# EAGLE design 01_giris (EAGLE 9.6.2)
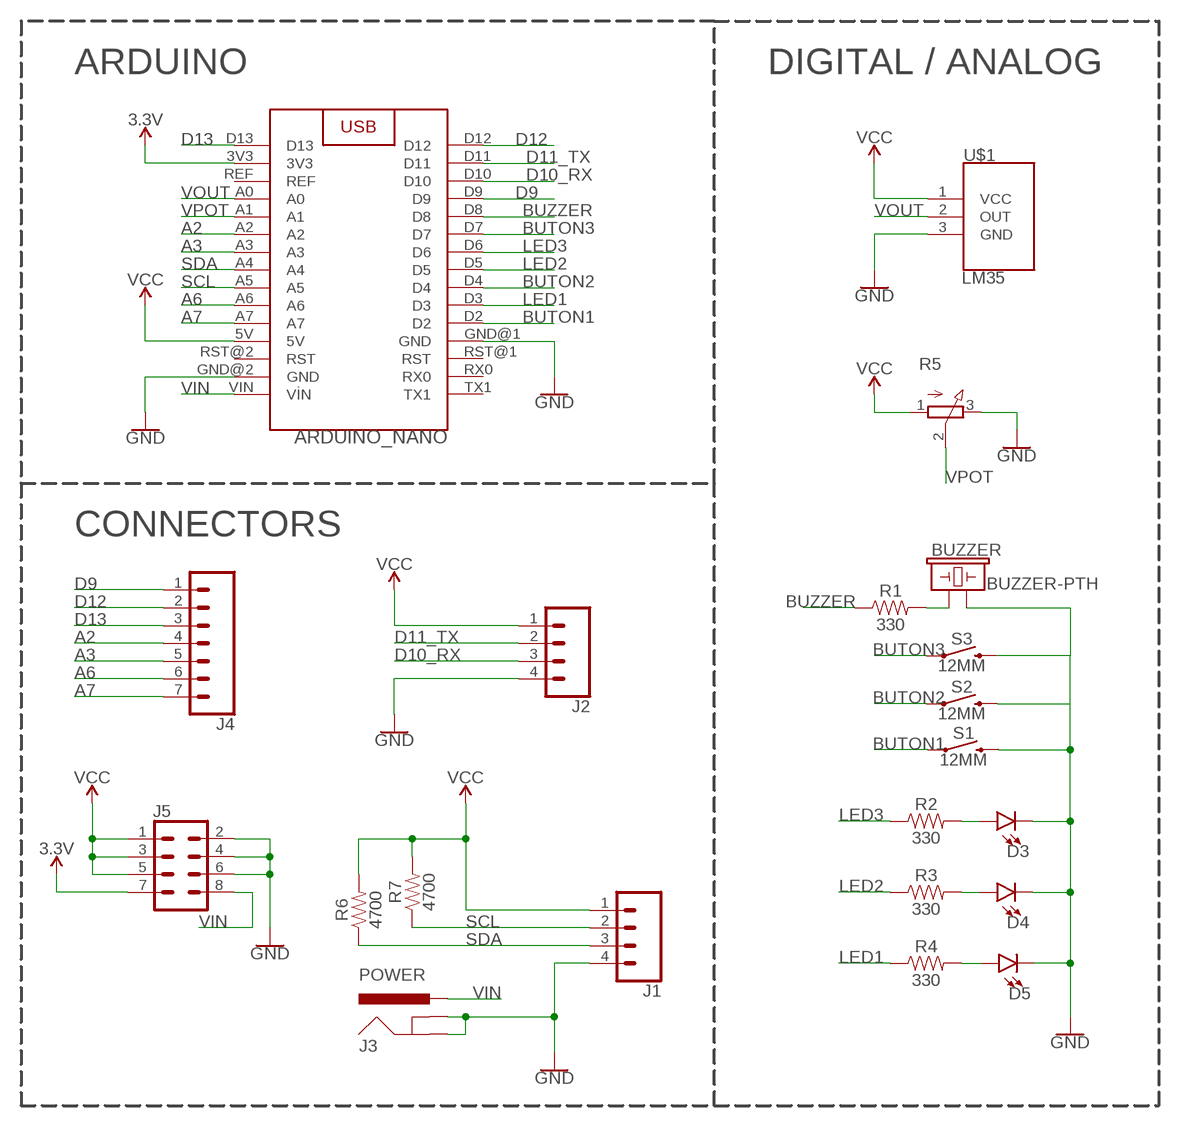
[diagram p0: schematic, sheet 1]

## Parts
ARDUINO_NANO  ARDUINO_NANO  [ARDUINO_NANO]
BUZZER  BUZZER-PTH  [BUZZER-12MM]
D3  LED-3MM-NO_SILK  [LED_3MM-NS]
D4  LED-3MM-NO_SILK  [LED_3MM-NS]
D5  LED-3MM-NO_SILK  [LED_3MM-NS]
J1  CONN_04  [1X04]
J2  CONN_04  [1X04]
J3  POWER  POWER_JACK  [POWER_JACK_PTH]
J4  CONN_07  [1X07]
J5  CONN_04X2  [2X4]
R1  330  1KOHM-HORIZ-1/4W-5%  [AXIAL-0.3]
R2  330  1KOHM-HORIZ-1/4W-5%  [AXIAL-0.3]
R3  330  1KOHM-HORIZ-1/4W-5%  [AXIAL-0.3]
R4  330  1KOHM-HORIZ-1/4W-5%  [AXIAL-0.3]
R5  3RP/1610N  [3RP/1610N]
R6  4700  1KOHM-HORIZ-1/4W-5%  [AXIAL-0.3]
R7  4700  1KOHM-HORIZ-1/4W-5%  [AXIAL-0.3]
S1  12MM  MOMENTARY-SWITCH-SPST-PTH-12MM  [TACTILE_SWITCH_PTH_12MM]
S2  12MM  MOMENTARY-SWITCH-SPST-PTH-12MM  [TACTILE_SWITCH_PTH_12MM]
S3  12MM  MOMENTARY-SWITCH-SPST-PTH-12MM  [TACTILE_SWITCH_PTH_12MM]
U$1  LM35  [TO-92]

## Nets
3.3V: ARDUINO_NANO.3V3 J5.7
A2: ARDUINO_NANO.A2 J4.4
A3: ARDUINO_NANO.A3 J4.5
A6: ARDUINO_NANO.A6 J4.6
A7: ARDUINO_NANO.A7 J4.7
BUTON1: ARDUINO_NANO.D2 S1.1
BUTON2: ARDUINO_NANO.D4 S2.1
BUTON3: ARDUINO_NANO.D7 S3.1
BUZZER: ARDUINO_NANO.D8 R1.P$1
D9: ARDUINO_NANO.D9 J4.1
D10_RX: ARDUINO_NANO.D10 J2.3
D11_TX: ARDUINO_NANO.D11 J2.2
D12: ARDUINO_NANO.D12 J4.2
D13: ARDUINO_NANO.D13 J4.3
GND: ARDUINO_NANO.GND@1(GND) ARDUINO_NANO.GND@2(GND) BUZZER.- D3.K(C) D4.K(C) D5.K(C) J1.4 J2.4 J3.GND J3.GNDBREAK J5.2 J5.4 J5.6 R5.3(E) S1.3 S2.3 S3.3 U$1.3(GND)
LED1: ARDUINO_NANO.D3 R4.P$1
LED2: ARDUINO_NANO.D5 R3.P$1
LED3: ARDUINO_NANO.D6 R2.P$1
N$1: BUZZER.+ R1.P$2
N$6: D3.A R2.P$2
N$7: D4.A R3.P$2
N$8: D5.A R4.P$2
SCL: ARDUINO_NANO.A5 J1.2 R7.P$1
SDA: ARDUINO_NANO.A4 J1.3 R6.P$1
VCC: ARDUINO_NANO.5V J1.1 J2.1 J5.1 J5.3 J5.5 R5.1(A) R6.P$2 R7.P$2 U$1.1(VCC)
VIN: ARDUINO_NANO.VIN(VİN) J3.PWR J5.8
VOUT: ARDUINO_NANO.A0 U$1.2(OUT)
VPOT: ARDUINO_NANO.A1 R5.2(S)
Unconnected: ARDUINO_NANO.REF ARDUINO_NANO.RST@1(RST) ARDUINO_NANO.RST@2(RST) ARDUINO_NANO.RX0 ARDUINO_NANO.TX1

## Notes on the sheet
- ARDUINO | DIGITAL / ANALOG
- CONNECTORS

## Library data of the parts
ARDUINO_NANO = ArduinoModelleri:ARDUINO_NANO: Arduino Nano Device
BUZZER = SparkFun-Electromechanical:BUZZER: Buzzer Small round buzzers that operate around the audible 2kHz range. You can use these as speakers to create simple music or user interfaces. Variant Overview: PTH - Mini Speaker - PC Mount 12mm 2.048kHz <https://www.sparkfun.com/products/7950> PTH_KIT - Mini Speaker - PC Mount 12mm 2.048kHz <https://www.sparkfun.com/products/7950> KIT simplifies soldering by adding stop mask to one side of the pads. PTH_NO_SILK - Mini Speaker - PC Mount 12mm 2.048kHz <https://www.sparkfun.com/products/7950> No silkscreen indicator of buzzer outline. PTH_KIT_NO_SILK - Mini Speaker - PC Mount 12mm 2.048kHz <https://www.sparkfun.com/products/7950> KIT package w/o silkscreen SMD - Buzzer Audio Magnetic (CCV-084B16) SMD buzzer used on, e.g. the LilyPad Buzzer <https://www.sparkfun.com/products/8463> and RFID USB Reader <https://www.sparkfun.com/products/9963>. SMD_KIT - Buzzer Audio Magnetic (CCV-084B16) SMD Buzzer with elongated pins to make soldering easier. Used on the SparkFun Simon Says - Surface Mount Soldering Kit <https://www.sparkfun.com/products/10935>.; PROD_ID: COMP-08253; SF_SKU: COM-07950
D3-D5 = SparkFun-LED:LED: LED (Generic) Standard schematic elements and footprints for 5mm, 3mm, 1206, and 0603 sized LEDs. Generic LEDs with no color specified.
J1 J2 = SparkFun-Connectors:CONN_04: Multi connection point. Often used as Generic Header-pin footprint for 0.1 inch spaced/style header connections On any of the 0.1 inch spaced packages, you can populate with these: Break Away Headers - Straight <https://www.sparkfun.com/products/116> (PRT-00116) Break Away Male Headers - Right Angle <https://www.sparkfun.com/products/553> (PRT-00553) Female Headers <https://www.sparkfun.com/products/115> (PRT-00115) Break Away Headers - Machine Pin <https://www.sparkfun.com/products/117> (PRT-00117) Break Away Female Headers - Swiss Machine Pin <https://www.sparkfun.com/products/743> (PRT-00743) For SCREWTERMINALS and SPRING TERMINALS visit here: Screw Terimnals on SparkFun.com <https://www.sparkfun.com/search/results?term=Screw+Terminals> (5mm/3.5mm/2.54mm spacing) This device is also useful as a general connection point to wire up your design to another part of your project. Our various solder wires solder well into these plated through hole pads. Hook-Up Wire - Assortment (Stranded, 22 AWG) <https://www.sparkfun.com/products/11375> (PRT-11375) Hook-Up Wire - Assortment (Solid Core, 22 AWG) <https://www.sparkfun.com/products/11367> (PRT-11367) View the entire wire category on our website here <https://www.sparkfun.com/categories/141> Special notes: Molex polarized connector foot print use with SKU : PRT-08231 with associated crimp pins and housings. 1MM SMD Version SKU: PRT-10208; PROD_ID: CONN-09696
J3 = SparkFun-Connectors:POWER_JACK: Power Jack Connector This is the standard 5.5mm barrel jack for power. The PTH is the most common, proven, reliable, footprint. The Slot footprint only works if the mill layer is transmitted to the PCB fab house so be warned. Here are the connectors we sell at SparkFun: DC Barrel Power Jack/Connector <https://www.sparkfun.com/products/119> (PRT-00119) DC Barrel Power Jack/Connector (SMD) <https://www.sparkfun.com/products/12748> (PRT-12748) DC Barrel Jack Adapter - Breadboard Compatible <https://www.sparkfun.com/products/10811> (PRT-10811) It is used on this SparkFun product (and many, many others): SparkFun RedBoard - Programmed with Arduino <https://www.sparkfun.com/products/12757> (DEV-12757) Also, if you need a mating power supply or connector, please check these out: Wall Adapter Power Supply - 9VDC 650mA <https://www.sparkfun.com/products/298> (TOL-00298) DC Barrel Jack Adapter - Male <https://www.sparkfun.com/products/10287> (PRT-10287); PROD_ID: CONN-08197
J4 = SparkFun-Connectors:CONN_07: Multi connection point. Often used as Generic Header-pin footprint for 0.1 inch spaced/style header connections On any of the 0.1 inch spaced packages, you can populate with these: Break Away Headers - Straight <https://www.sparkfun.com/products/116> (PRT-00116) Break Away Male Headers - Right Angle <https://www.sparkfun.com/products/553> (PRT-00553) Female Headers <https://www.sparkfun.com/products/115> (PRT-00115) Break Away Headers - Machine Pin <https://www.sparkfun.com/products/117> (PRT-00117) Break Away Female Headers - Swiss Machine Pin <https://www.sparkfun.com/products/743> (PRT-00743) For SCREWTERMINALS and SPRING TERMINALS visit here: Screw Terimnals on SparkFun.com <https://www.sparkfun.com/search/results?term=Screw+Terminals> (5mm/3.5mm/2.54mm spacing) This device is also useful as a general connection point to wire up your design to another part of your project. Our various solder wires solder well into these plated through hole pads. Hook-Up Wire - Assortment (Stranded, 22 AWG) <https://www.sparkfun.com/products/11375> (PRT-11375) Hook-Up Wire - Assortment (Solid Core, 22 AWG) <https://www.sparkfun.com/products/11367> (PRT-11367) View the entire wire category on our website here <https://www.sparkfun.com/categories/141> Special notes: Molex polarized connector foot print use with SKU : PRT-08231 with associated crimp pins and housings. 1MM SMD Version SKU: PRT-10208 NOTES ON THE VARIANTS LOCK and LOCK_LONGPADS... This footprint was designed to help hold the alignment of a through-hole component (i.e. 6-pin header) while soldering it into place. You may notice that each hole has been shifted either up or down by 0.005 of an inch from it's more standard position (which is a perfectly straight line). This slight alteration caused the pins (the squares in the middle) to touch the edges of the holes. Because they are alternating, it causes a "brace" to hold the component in place. 0.005 has proven to be the perfect amount of "off-center" position when using our standard breakaway headers. Although looks a little odd when you look at the bare footprint, once you have a header in there, the alteration is very hard to notice. Also,if you push a header all the way into place, it is covered up entirely on the bottom side.
J5 = SparkFun-Connectors:CONN_04X2: Multi connection point. Often used as Generic Header-pin footprint for 0.1 inch spaced/style header connections On any of the 0.1 inch spaced packages, you can populate with these: Break Away Headers - Straight <https://www.sparkfun.com/products/116> (PRT-00116) Break Away Male Headers - Right Angle <https://www.sparkfun.com/products/553> (PRT-00553) Female Headers <https://www.sparkfun.com/products/115> (PRT-00115) Break Away Headers - Machine Pin <https://www.sparkfun.com/products/117> (PRT-00117) Break Away Female Headers - Swiss Machine Pin <https://www.sparkfun.com/products/743> (PRT-00743)
R1-R4 R6 R7 = SparkFun-Resistors:1KOHM: 1kΩ resistor A resistor is a passive two-terminal electrical component that implements electrical resistance as a circuit element. Resistors act to reduce current flow, and, at the same time, act to lower voltage levels within circuits. - Wikipedia; PROD_ID: RES-08380; VALUE: 1k
R5 = pot:3RP/1610N: 16mm Potentiometer one level Source: http://www.alphapotentiometers.net/html/16mm_pot_2.html
S1-S3 = SparkFun-Switches:MOMENTARY-SWITCH-SPST: Momentary Switch (Pushbutton) - SPST Normally-open (NO) SPST momentary switches (buttons, pushbuttons). Variants PTH-12MM - 12mm square, through-hole Momentary Pushbutton Switch - 12mm Square <https://www.sparkfun.com/products/9190> (COM-09190) PTH-6.0MM, PTH-6.0MM-KIT - 6.0mm square, through-hole Mini Pushbutton Switch <https://www.sparkfun.com/products/97> (COM-00097) KIT package intended for soldering kit's - only one side of pads' copper is exposed. PTH-RIGHT-ANGLE-KIT - Right-angle, through-hole Right Angle Tactile Button <https://www.sparkfun.com/products/10791> - Used on SparkFun BigTime Watch Kit <https://www.sparkfun.com/products/11734> SMD-12MM - 12mm square, surface-mount Tactile Button - SMD (12mm) <https://www.sparkfun.com/products/12993> (COM-12993) Used on SparkFun PicoBoard <https://www.sparkfun.com/products/11888> SMD-4.5MM - 4.5mm Square Trackball Switch Used on SparkFun Blackberry Trackballer Breakout <https://www.sparkfun.com/products/13169> SMD-4.6MMX2.8MM - 4.60mm x 2.80mm, surface mount Used on SparkFun SAMD21 Mini Breakout <https://www.sparkfun.com/products/13664> SMD-5.2MM, SMD-5.2-REDUNDANT - 5.2mm square, surface-mount Mini Pushbutton Switch - SMD <https://www.sparkfun.com/products/8720> (COM-08720) Used on Arduino Pro Mini <https://www.sparkfun.com/products/11114> REDUNDANT package connects both switch circuits together SMD-6.0X3.5MM - 6.0 x 3.5mm, surface mount Momentary Reset Switch SMD <https://www.sparkfun.com/products/8229> (COM-08229) SMD-6.2MM-TALL - 6.2mm square, surface mount Tactile Button - SMD (6mm) <https://www.sparkfun.com/products/12992> Used on SparkFun Digital Sandbox <https://www.sparkfun.com/products/12651> SMD-RIGHT-ANGLE - Right-angle, surface mount Used on SparkFun Block for Intel® Edison - Arduino <https://www.sparkfun.com/products/13036>; PROD_ID: SWCH-09185; SF_SKU: COM-09190
U$1 = ArduinoModelleri:LM35

## Board
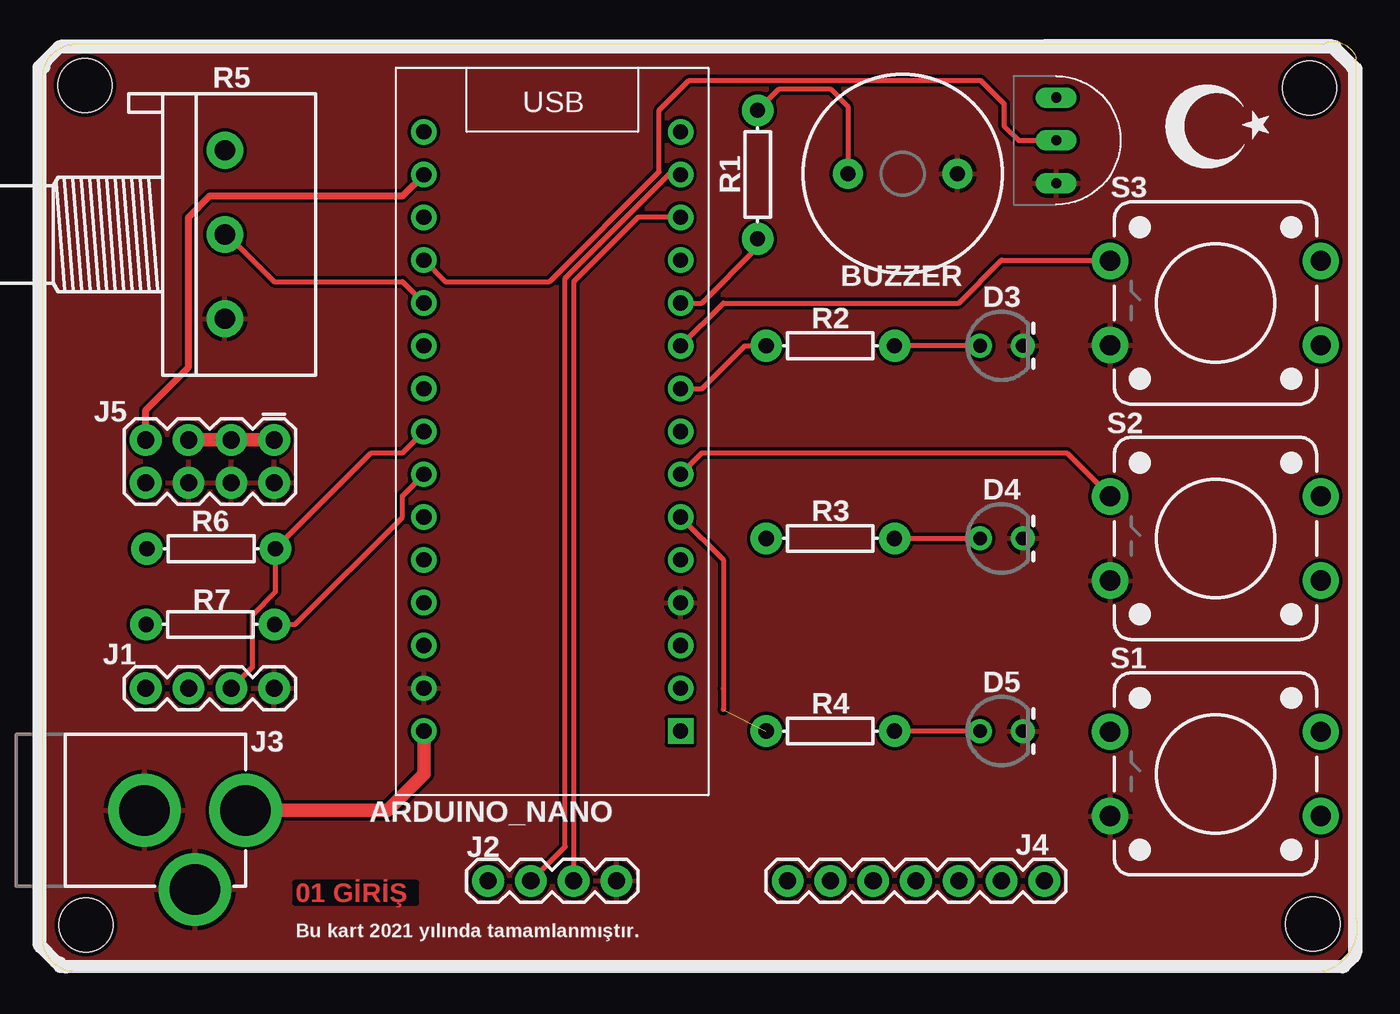
[diagram p1: board, top side]
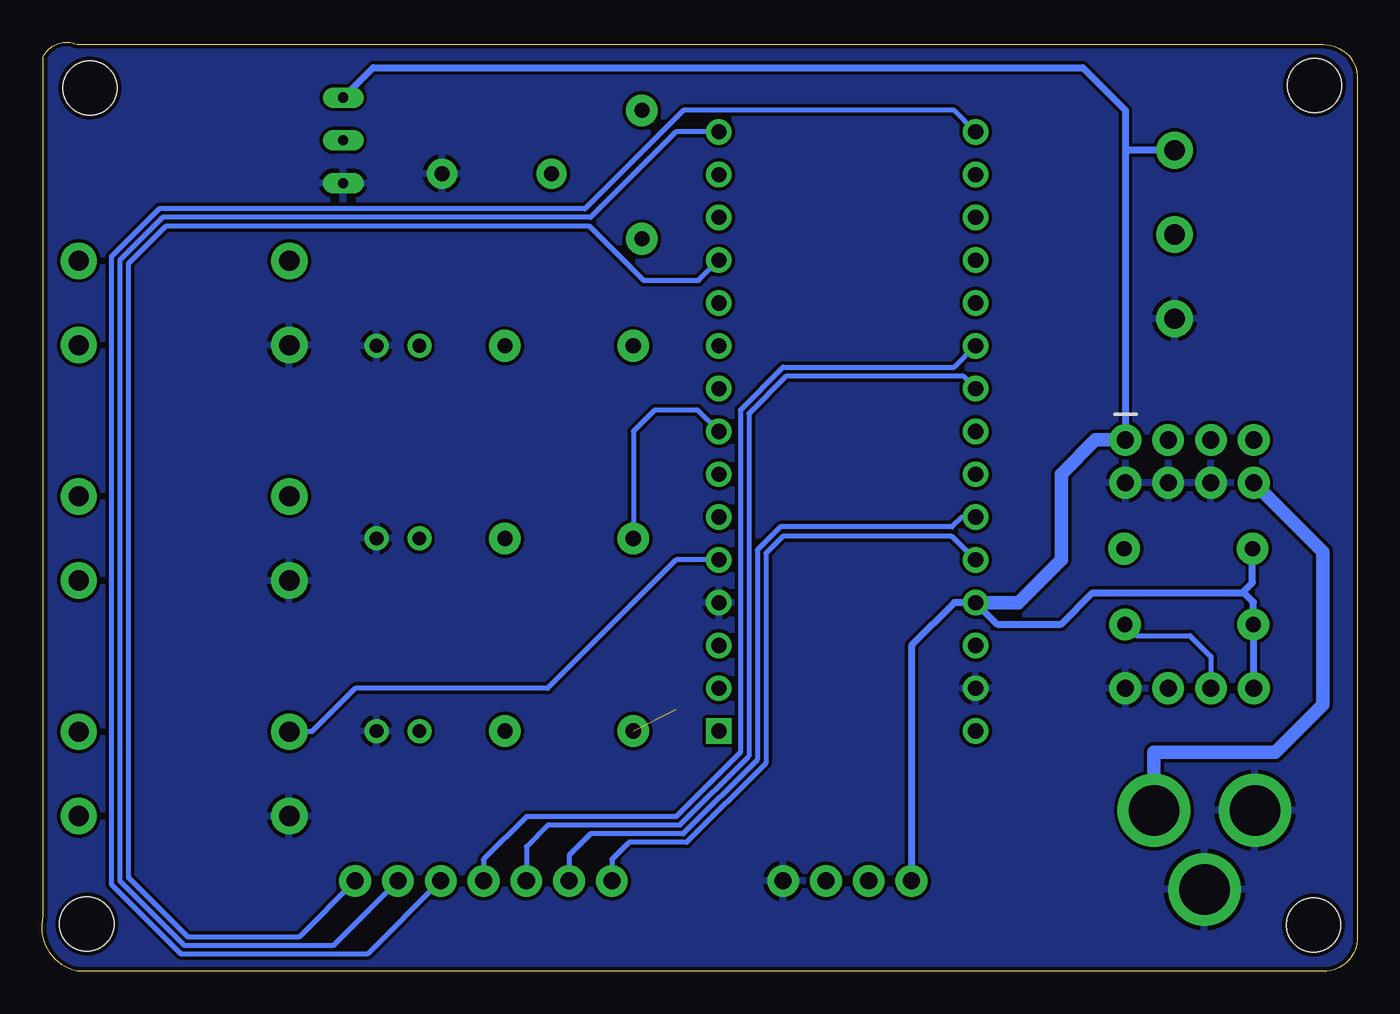
[diagram p2: board, bottom side, seen from below]

Size 78.07 x 55.14 mm. Coordinates in mm from the lower left corner, seen from the top.
Outline: 76,55 2,55 arc90 0,53 0,2 arc90 2,0 76,0 arc90 78,3.27 78,54.27 arc90 76,55
Copper layers (1*16): Top 0.035mm / dielectric 1.5mm / Bottom 0.035mm
Design rules "SparkFun": minimum track width 8mil, minimum drill 20mil, track to track 8mil, track to pad 8mil, pad to pad 8mil, via to via 8mil, smd to smd 8mil, copper to edge 10mil, drill to drill 8mil, minimum pad ring 12mil, minimum via ring 10mil, stop-mask expansion 4mil, vias tented up to drill 25mil, thermal gap 10mil
Holes 3.2 mm at 75.23,52.43 75.43,2.81 2.55,52.56 2.6,2.75

### Footprints (pad centres in the part's own frame; a part is rotated, then mirrored left to right if it is on the bottom)
ARDUINO_NANO = drill 0.9: 3V3 7.62,-15.24; 5V 7.62,10.16; A0 7.62,-10.16; A1 7.62,-7.62; A2 7.62,-5.08; A3 7.62,-2.54; A4 7.62,0; A5 7.62,2.54; A6 7.62,5.08; A7 7.62,7.62; D2 -7.62,7.62; D3 -7.62,5.08; D4 -7.62,2.54; D5 -7.62,0; D6 -7.62,-2.54; D7 -7.62,-5.08; D8 -7.62,-7.62; D9 -7.62,-10.16; D10 -7.62,-12.7; D11 -7.62,-15.24; D12 -7.62,-17.78; D13 7.62,-17.78; GND@1 -7.62,10.16; GND@2 7.62,15.24; REF 7.62,-12.7; RST@1 -7.62,12.7; RST@2 7.62,12.7; RX0 -7.62,15.24; VIN 7.62,17.78 | drill 0.9 square: TX1 -7.62,17.78
BUZZER-12MM = drill 0.9 pad 1.778: + 3.25,0; - -3.25,0
LED_3MM-NS = drill 0.813: A -1.27,0; K 1.27,0
1X04 = drill 1.016 pad 1.88: 1 0,0; 2 2.54,0; 3 5.08,0; 4 7.62,0
POWER_JACK_PTH = drill 2.997 pad 4.318: GND 0,7.7; GNDBREAK 4.7,10.7; PWR 0,13.7
1X07 = drill 1.016 pad 1.88: 1 0,0; 2 2.54,0; 3 5.08,0; 4 7.62,0; 5 10.16,0; 6 12.7,0; 7 15.24,0
2X4 = drill 1.016 pad 1.88: 1 -3.81,-1.27; 2 -3.81,1.27; 3 -1.27,-1.27; 4 -1.27,1.27; 5 1.27,-1.27; 6 1.27,1.27; 7 3.81,-1.27; 8 3.81,1.27
AXIAL-0.3 = drill 0.9 pad 1.88: P$1 -3.81,0; P$2 3.81,0
3RP/1610N = drill 1.2 pad 2.184: 1 -5,0; 2 0,0; 3 5,0
TACTILE_SWITCH_PTH_12MM = drill 1.2 pad 2.159: 1 6.25,-2.5; 2 -6.25,-2.5; 3 6.25,2.5; 4 -6.25,2.5
TO-92 = drill 0.6 long: 1 1.27,0; 2 3.81,0; 3 6.35,0

### Placement (x,y rotation side)
ARDUINO_NANO  30.28,32.04 180 top
BUZZER  51.08,47.33 180 top
D3  56.95,37.12 0 top
D4  56.95,25.69 0 top
D5  56.95,14.26 0 top
J1  6.15,16.8 0 top
J2  26.47,5.37 0 top
J3  -1.62,9.56 270 top
J4  59.49,5.37 180 top
J5  9.96,30.26 180 top
R1  42.47,47.28 90 top
R2  46.79,37.12 0 top
R3  46.79,25.69 0 top
R4  46.79,14.26 0 top
R5  10.85,43.72 270 top
R6  10.04,25.08 180 top
R7  9.99,20.58 180 top
S1  69.65,11.72 180 top
S2  69.65,25.69 180 top
S3  69.65,39.66 180 top
U$1  60.2,53.12 270 top
U$9  [TR_MINI]  65.5,47.09 0 top

### Tracks (layer width: path | path; a pad name or v marks a point on that pad's centre or on a via)
3.3V
  Top 0.406: J5.7 6.15,33.31 8.69,35.85 8.69,44.74 9.96,46.01 21.39,46.01 ARDUINO_NANO.3V3
A2
  Bottom 0.305: J4.4 51.87,6.64 49.33,9.18 40.44,9.18 36.63,12.99 36.63,33.31 34.09,35.85 23.93,35.85 ARDUINO_NANO.A2
A3
  Bottom 0.305: ARDUINO_NANO.A3 23.42,35.34 33.88,35.34 36.12,33.1 36.12,12.78 40.23,8.67 48.06,8.67 49.33,7.4 J4.5
A6
  Bottom 0.305: J4.6 46.79,6.89 45.52,8.16 40.02,8.16 35.61,12.57 35.61,25.01 34.25,26.38 24.06,26.38 23.47,26.96 ARDUINO_NANO.A6
A7
  Bottom 0.305: ARDUINO_NANO.A7 24.06,25.82 34.09,25.82 35.11,24.8 35.11,12.36 39.81,7.66 43.23,7.66 44.25,6.64 J4.7
BUTON1
  Bottom 0.305: S1.1 62.07,14.22 59.49,16.8 48.06,16.8 40.44,24.42 ARDUINO_NANO.D2
BUTON2
  Top 0.305: ARDUINO_NANO.D4 39.17,30.77 60.82,30.77 S2.1
BUTON3
  Top 0.305: S3.1 63.36,42.2 56.95,42.2 54.41,39.66 40.44,39.66 ARDUINO_NANO.D7
BUZZER
  Top 0.305: ARDUINO_NANO.D8 39.17,39.66 42.47,42.96 R1.P$1
D9
  Bottom 0.305: ARDUINO_NANO.D9 39.1,41 42.37,41 45.57,44.21 70.73,44.21 72.95,41.99 72.95,5.58 69.44,2.07 62.79,2.07 J4.1
D10_RX
  Top 0.305: ARDUINO_NANO.D10 35.36,44.74 31.55,40.93 J2.3
D11_TX
  Top 0.305: J2.2 31.04,7.4 31.04,41.14 37.18,47.28 ARDUINO_NANO.D11
D12
  Bottom 0.305: ARDUINO_NANO.D12 40.44,49.82 45.52,44.74 70.92,44.74 73.46,42.2 73.46,5.37 69.65,1.56 60.76,1.56 J4.2
D13
  Bottom 0.305: ARDUINO_NANO.D13 23.93,51.09 40.01,51.09 45.85,45.25 71.13,45.25 73.97,42.41 73.97,5.16 69.86,1.05 58.73,1.05 J4.3
GND
  pour Top: -2.74,57.44 -2.74,-2.25 81.08,-2.25 81.08,57.44
  pour Bottom: -5.28,57.44 -5.28,-4.79 83.62,-4.79 83.62,59.98 -5.28,59.98
LED1  (1 unrouted)
  Top 0.305: ARDUINO_NANO.D3 40.44,24.42 40.44,16.8 40.44,15.53
LED2
  Bottom 0.305: ARDUINO_NANO.D5 39.17,33.31 41.71,33.31 42.98,32.04 R3.P$1
LED3
  Top 0.305: ARDUINO_NANO.D6 39.17,34.58 41.71,37.12 R2.P$1
N$1
  Top 0.305: R1.P$2 43.74,52.36 46.79,52.36 47.83,51.32 BUZZER.+
N$6
  Top 0.305: D3.A R2.P$2
N$7
  Top 0.305: R3.P$2 D4.A
N$8
  Top 0.305: D5.A R4.P$2
SCL
  Top 0.305: R7.P$1 15.01,20.59 21.39,26.96 21.39,28.23 ARDUINO_NANO.A5
  Bottom 0.305: R7.P$1 13.13,19.92 9.93,19.92 8.69,18.68 J1.2
SDA
  Top 0.305: ARDUINO_NANO.A4 21.39,30.77 19.54,30.77 R6.P$1 13.85,22.52 12.48,21.15 12.48,18.05 J1.3
VCC
  Top 0.813: J5.5 J5.3 J5.1
  Bottom 0.406: 6.84,22.46 6.23,23.07 R6.P$2 | 6.84,22.46 15.73,22.46 17.58,20.61 21.39,20.61 ARDUINO_NANO.5V 23.93,21.88 26.47,19.34 J2.1 | 6.84,22.46 6.73,22.46 6.17,21.91 R7.P$2 6.17,16.83 J1.1 | U$1.1 58.42,53.63 16.31,53.63 13.77,51.09 13.77,48.55 | 13.77,48.55 J5.1 | R5.1 13.6,48.72 13.77,48.55
  Bottom 0.813: ARDUINO_NANO.5V 20.12,21.88 17.58,24.42 17.58,29.5 15.55,31.53 J5.1
VIN
  Top 0.813: J3.PWR 20.5,9.56 22.66,11.72 ARDUINO_NANO.VIN
  Bottom 0.813: J5.8 2.06,24.9 2.06,15.81 4.88,12.99 12.08,12.99 J3.PWR
VOUT
  Top 0.305: U$1.2 57.97,49.31 57.1,50.18 57.1,51.47 55.7,52.87 38.41,52.87 36.63,51.09 36.63,47.45 30.11,40.93 23.93,40.93 ARDUINO_NANO.A0
VPOT
  Top 0.305: R5.2 10.98,43.72 13.77,40.93 21.39,40.93 ARDUINO_NANO.A1

### Text on the board
Top: 01 GİRİŞ
tPlace: Bu kart 2021 yılında tamamlanmıştır.
tStop: 01 GİRİŞ